# Altium project 48FE+2GE+2SFP.PrjPcb (part 4 of 9)

## Sheet 15_FE_PORT_1-8.SchDoc
size 594 x 420 mm; Author: Serbinov O.A.; CompanyName: ELSICOM; DrawnBy: Serbinov O.A.; Engineer: Serbinov O.A.; Organization: Elsicom; Address1: Kirova avenue, 58; Address2: Tomsk; Address3: Russia 634012; DocumentNumber: 16; SheetNumber: 16; SheetTotal: 44; ProjectName: 48_PORTS
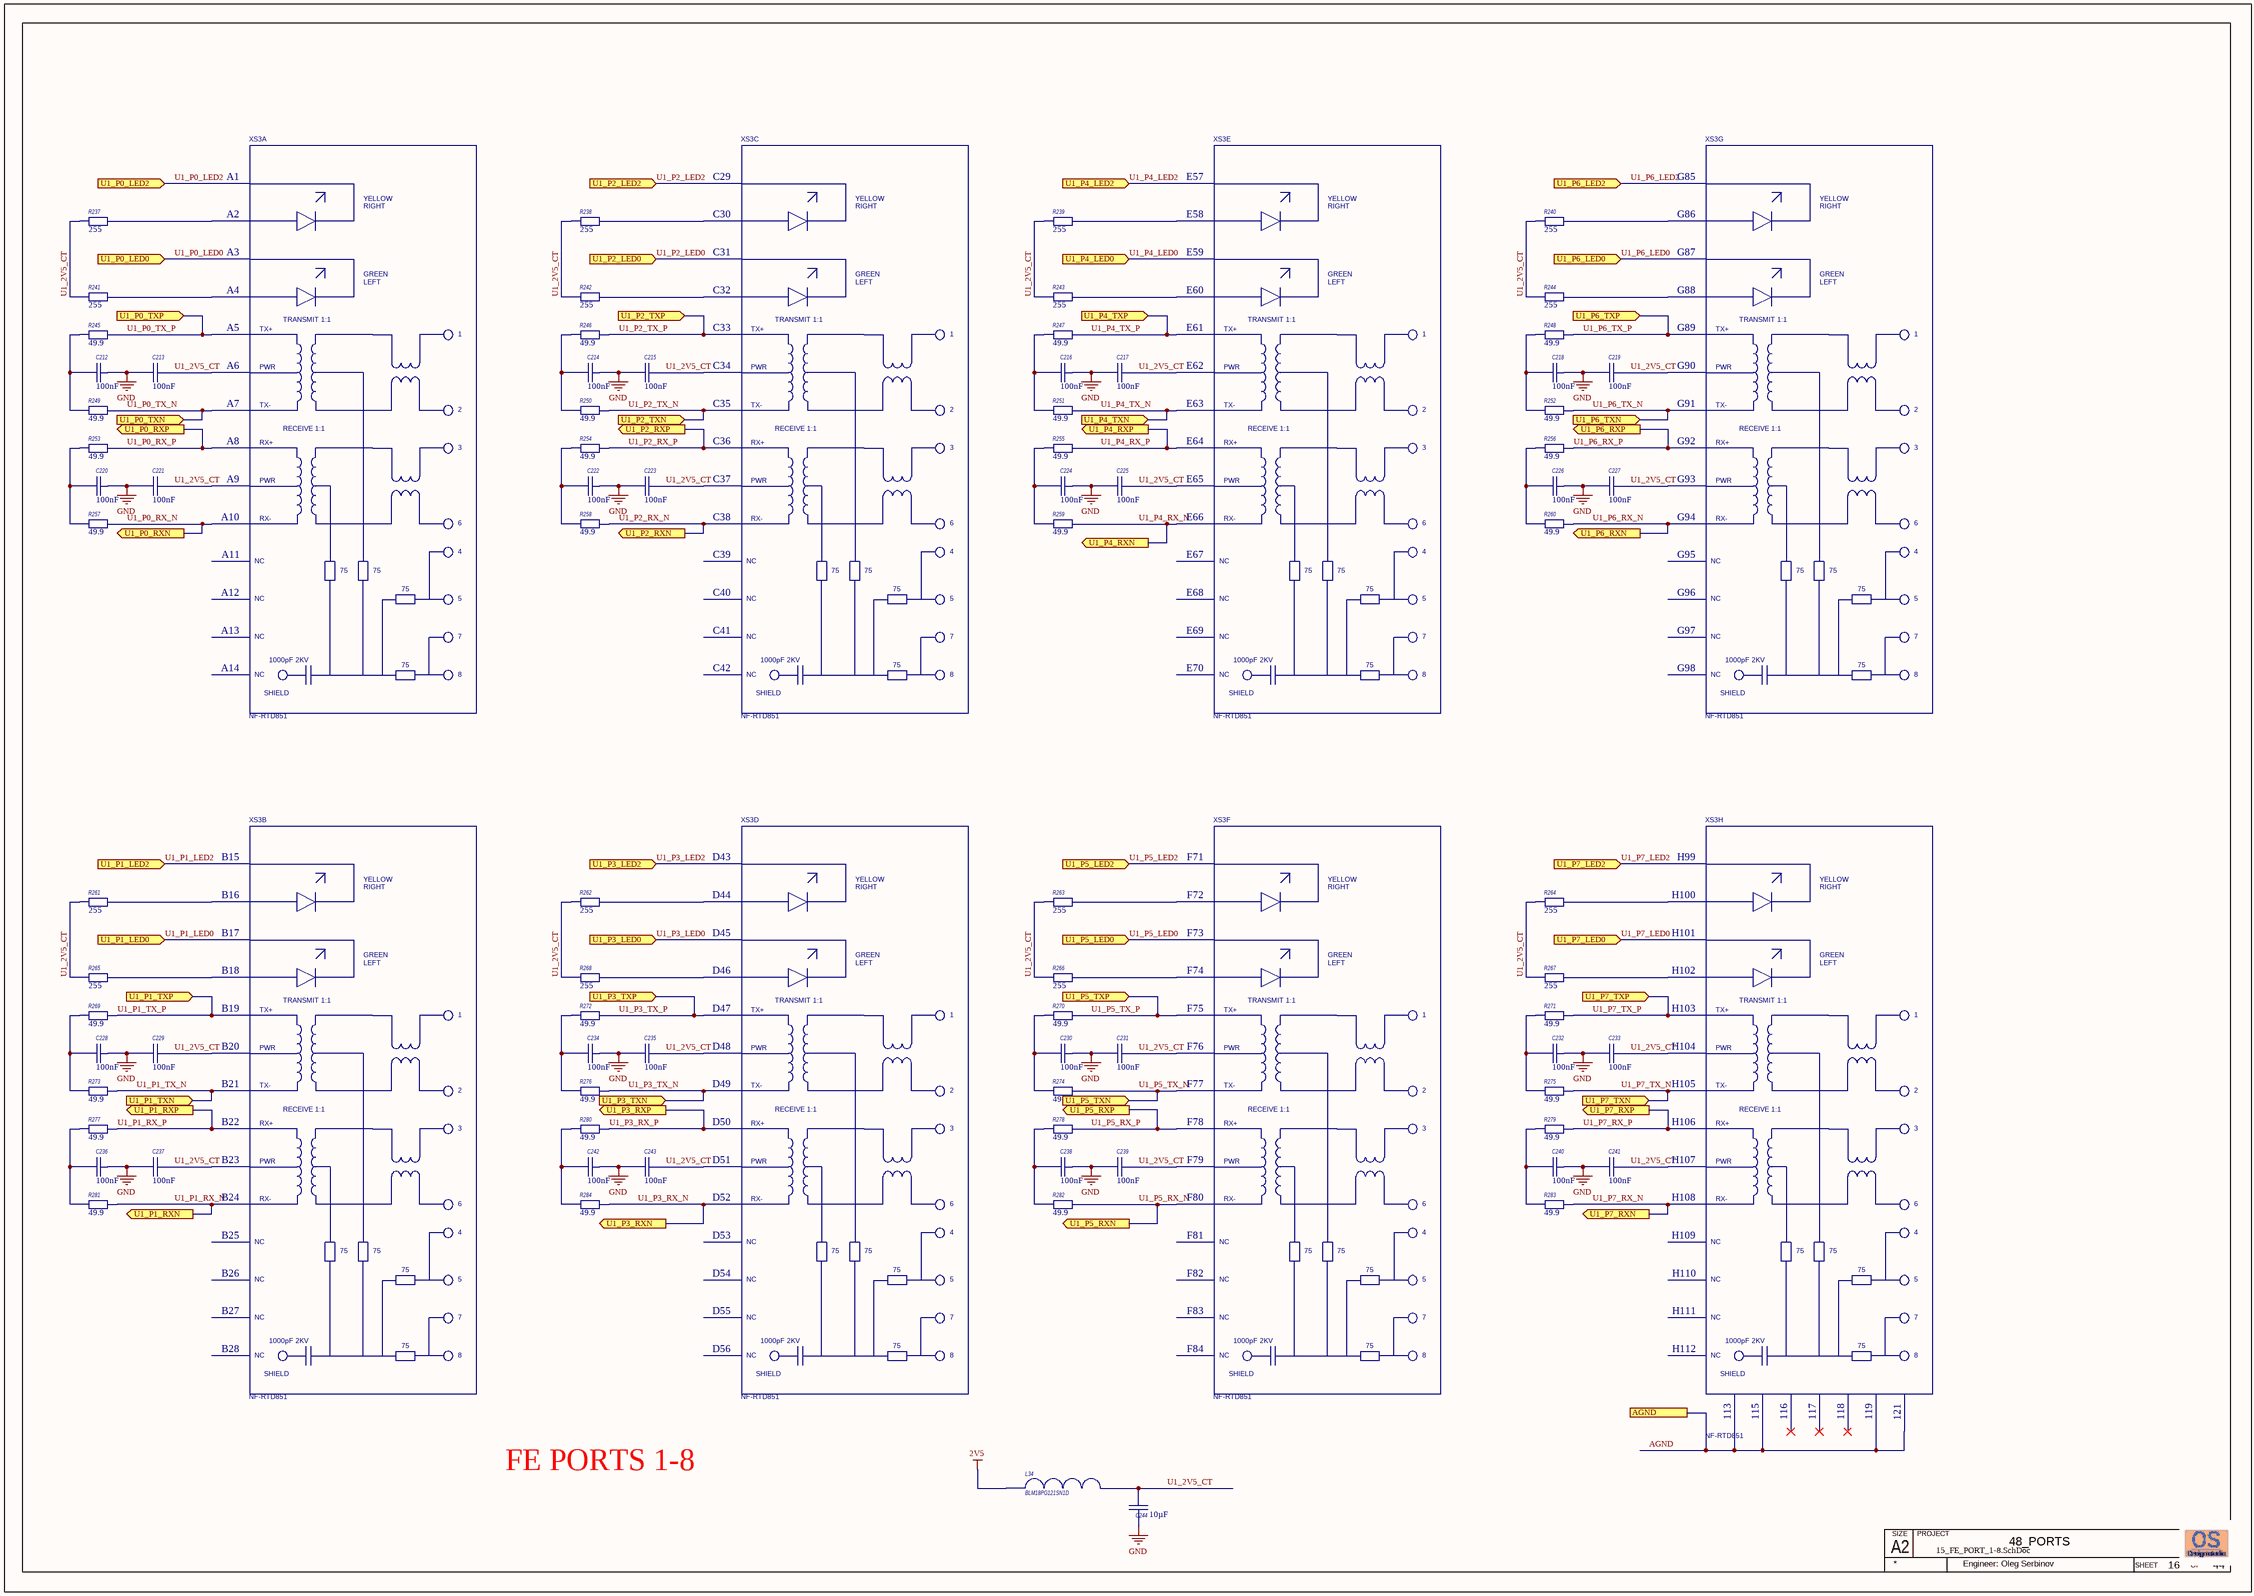
[diagram p9: 15_FE_PORT_1-8.SchDoc]

### Parts
C212  Capacitance: 100nF  [C0402_IPC High Density]  (hidden comment: GRM155R71E104KE14D)
C213  Capacitance: 100nF  [C0402_IPC High Density]  (hidden comment: GRM155R71E104KE14D)
C214  Capacitance: 100nF  [C0402_IPC High Density]  (hidden comment: GRM155R71E104KE14D)
C215  Capacitance: 100nF  [C0402_IPC High Density]  (hidden comment: GRM155R71E104KE14D)
C216  Capacitance: 100nF  [C0402_IPC High Density]  (hidden comment: GRM155R71E104KE14D)
C217  Capacitance: 100nF  [C0402_IPC High Density]  (hidden comment: GRM155R71E104KE14D)
C218  Capacitance: 100nF  [C0402_IPC High Density]  (hidden comment: GRM155R71E104KE14D)
C219  Capacitance: 100nF  [C0402_IPC High Density]  (hidden comment: GRM155R71E104KE14D)
C220  Capacitance: 100nF  [C0402_IPC High Density]  (hidden comment: GRM155R71E104KE14D)
C221  Capacitance: 100nF  [C0402_IPC High Density]  (hidden comment: GRM155R71E104KE14D)
C222  Capacitance: 100nF  [C0402_IPC High Density]  (hidden comment: GRM155R71E104KE14D)
C223  Capacitance: 100nF  [C0402_IPC High Density]  (hidden comment: GRM155R71E104KE14D)
C224  Capacitance: 100nF  [C0402_IPC High Density]  (hidden comment: GRM155R71E104KE14D)
C225  Capacitance: 100nF  [C0402_IPC High Density]  (hidden comment: GRM155R71E104KE14D)
C226  Capacitance: 100nF  [C0402_IPC High Density]  (hidden comment: GRM155R71E104KE14D)
C227  Capacitance: 100nF  [C0402_IPC High Density]  (hidden comment: GRM155R71E104KE14D)
C228  Capacitance: 100nF  [C0402_IPC High Density]  (hidden comment: GRM155R71E104KE14D)
C229  Capacitance: 100nF  [C0402_IPC High Density]  (hidden comment: GRM155R71E104KE14D)
C230  Capacitance: 100nF  [C0402_IPC High Density]  (hidden comment: GRM155R71E104KE14D)
C231  Capacitance: 100nF  [C0402_IPC High Density]  (hidden comment: GRM155R71E104KE14D)
C232  Capacitance: 100nF  [C0402_IPC High Density]  (hidden comment: GRM155R71E104KE14D)
C233  Capacitance: 100nF  [C0402_IPC High Density]  (hidden comment: GRM155R71E104KE14D)
C234  Capacitance: 100nF  [C0402_IPC High Density]  (hidden comment: GRM155R71E104KE14D)
C235  Capacitance: 100nF  [C0402_IPC High Density]  (hidden comment: GRM155R71E104KE14D)
C236  Capacitance: 100nF  [C0402_IPC High Density]  (hidden comment: GRM155R71E104KE14D)
C237  Capacitance: 100nF  [C0402_IPC High Density]  (hidden comment: GRM155R71E104KE14D)
C238  Capacitance: 100nF  [C0402_IPC High Density]  (hidden comment: GRM155R71E104KE14D)
C239  Capacitance: 100nF  [C0402_IPC High Density]  (hidden comment: GRM155R71E104KE14D)
C240  Capacitance: 100nF  [C0402_IPC High Density]  (hidden comment: GRM155R71E104KE14D)
C241  Capacitance: 100nF  [C0402_IPC High Density]  (hidden comment: GRM155R71E104KE14D)
C242  Capacitance: 100nF  [C0402_IPC High Density]  (hidden comment: GRM155R71E104KE14D)
C243  Capacitance: 100nF  [C0402_IPC High Density]  (hidden comment: GRM155R71E104KE14D)
C244  Capacitance: 10µF  [CAPC2012[0805]]  (hidden comment: GRM21BR61C106KE15)
L34  BLM18PG121SN1D  [INDC1608X95N]
R237  Resistance (Ohms): 255  [RESC1005[0402]]  (hidden comment: ERJ-2RKF2550X)
R238  Resistance (Ohms): 255  [RESC1005[0402]]  (hidden comment: ERJ-2RKF2550X)
R239  Resistance (Ohms): 255  [RESC1005[0402]]  (hidden comment: ERJ-2RKF2550X)
R240  Resistance (Ohms): 255  [RESC1005[0402]]  (hidden comment: ERJ-2RKF2550X)
R241  Resistance (Ohms): 255  [RESC1005[0402]]  (hidden comment: ERJ-2RKF2550X)
R242  Resistance (Ohms): 255  [RESC1005[0402]]  (hidden comment: ERJ-2RKF2550X)
R243  Resistance (Ohms): 255  [RESC1005[0402]]  (hidden comment: ERJ-2RKF2550X)
R244  Resistance (Ohms): 255  [RESC1005[0402]]  (hidden comment: ERJ-2RKF2550X)
R245  Resistance: 49.9  [R0402_IPC High Density]  (hidden comment: ERJ-2RKF49R9X)
R246  Resistance: 49.9  [R0402_IPC High Density]  (hidden comment: ERJ-2RKF49R9X)
R247  Resistance: 49.9  [R0402_IPC High Density]  (hidden comment: ERJ-2RKF49R9X)
R248  Resistance: 49.9  [R0402_IPC High Density]  (hidden comment: ERJ-2RKF49R9X)
R249  Resistance: 49.9  [R0402_IPC High Density]  (hidden comment: ERJ-2RKF49R9X)
R250  Resistance: 49.9  [R0402_IPC High Density]  (hidden comment: ERJ-2RKF49R9X)
R251  Resistance: 49.9  [R0402_IPC High Density]  (hidden comment: ERJ-2RKF49R9X)
R252  Resistance: 49.9  [R0402_IPC High Density]  (hidden comment: ERJ-2RKF49R9X)
R253  Resistance: 49.9  [R0402_IPC High Density]  (hidden comment: ERJ-2RKF49R9X)
R254  Resistance: 49.9  [R0402_IPC High Density]  (hidden comment: ERJ-2RKF49R9X)
R255  Resistance: 49.9  [R0402_IPC High Density]  (hidden comment: ERJ-2RKF49R9X)
R256  Resistance: 49.9  [R0402_IPC High Density]  (hidden comment: ERJ-2RKF49R9X)
R257  Resistance: 49.9  [R0402_IPC High Density]  (hidden comment: ERJ-2RKF49R9X)
R258  Resistance: 49.9  [R0402_IPC High Density]  (hidden comment: ERJ-2RKF49R9X)
R259  Resistance: 49.9  [R0402_IPC High Density]  (hidden comment: ERJ-2RKF49R9X)
R260  Resistance: 49.9  [R0402_IPC High Density]  (hidden comment: ERJ-2RKF49R9X)
R261  Resistance (Ohms): 255  [RESC1005[0402]]  (hidden comment: ERJ-2RKF2550X)
R262  Resistance (Ohms): 255  [RESC1005[0402]]  (hidden comment: ERJ-2RKF2550X)
R263  Resistance (Ohms): 255  [RESC1005[0402]]  (hidden comment: ERJ-2RKF2550X)
R264  Resistance (Ohms): 255  [RESC1005[0402]]  (hidden comment: ERJ-2RKF2550X)
R265  Resistance (Ohms): 255  [RESC1005[0402]]  (hidden comment: ERJ-2RKF2550X)
R266  Resistance (Ohms): 255  [RESC1005[0402]]  (hidden comment: ERJ-2RKF2550X)
R267  Resistance (Ohms): 255  [RESC1005[0402]]  (hidden comment: ERJ-2RKF2550X)
R268  Resistance (Ohms): 255  [RESC1005[0402]]  (hidden comment: ERJ-2RKF2550X)
R269  Resistance: 49.9  [R0402_IPC High Density]  (hidden comment: ERJ-2RKF49R9X)
R270  Resistance: 49.9  [R0402_IPC High Density]  (hidden comment: ERJ-2RKF49R9X)
R271  Resistance: 49.9  [R0402_IPC High Density]  (hidden comment: ERJ-2RKF49R9X)
R272  Resistance: 49.9  [R0402_IPC High Density]  (hidden comment: ERJ-2RKF49R9X)
R273  Resistance: 49.9  [R0402_IPC High Density]  (hidden comment: ERJ-2RKF49R9X)
R274  Resistance: 49.9  [R0402_IPC High Density]  (hidden comment: ERJ-2RKF49R9X)
R275  Resistance: 49.9  [R0402_IPC High Density]  (hidden comment: ERJ-2RKF49R9X)
R276  Resistance: 49.9  [R0402_IPC High Density]  (hidden comment: ERJ-2RKF49R9X)
R277  Resistance: 49.9  [R0402_IPC High Density]  (hidden comment: ERJ-2RKF49R9X)
R278  Resistance: 49.9  [R0402_IPC High Density]  (hidden comment: ERJ-2RKF49R9X)
R279  Resistance: 49.9  [R0402_IPC High Density]  (hidden comment: ERJ-2RKF49R9X)
R280  Resistance: 49.9  [R0402_IPC High Density]  (hidden comment: ERJ-2RKF49R9X)
R281  Resistance: 49.9  [R0402_IPC High Density]  (hidden comment: ERJ-2RKF49R9X)
R282  Resistance: 49.9  [R0402_IPC High Density]  (hidden comment: ERJ-2RKF49R9X)
R283  Resistance: 49.9  [R0402_IPC High Density]  (hidden comment: ERJ-2RKF49R9X)
R284  Resistance: 49.9  [R0402_IPC High Density]  (hidden comment: ERJ-2RKF49R9X)
XS3  NF-RTD851  [NF-RTD851_2X4_LED_NF-RTD851_2X4_LED(Primary)]  (parts A,B,C,D,E,F,G,H of 8)

### Ports
AGND, U1_P0_LED0 (in), U1_P0_LED2 (in), U1_P0_RXN (out), U1_P0_RXP (out), U1_P0_TXN (in), U1_P0_TXP (in), U1_P1_LED0 (in), U1_P1_LED2 (in), U1_P1_RXN (out), U1_P1_RXP (out), U1_P1_TXN (in), U1_P1_TXP (in), U1_P2_LED0 (in), U1_P2_LED2 (in), U1_P2_RXN (out), U1_P2_RXP (out), U1_P2_TXN (in), U1_P2_TXP (in), U1_P3_LED0 (in), U1_P3_LED2 (in), U1_P3_RXN (out), U1_P3_RXP (out), U1_P3_TXN (in), U1_P3_TXP (in), U1_P4_LED0 (in), U1_P4_LED2 (in), U1_P4_RXN (out), U1_P4_RXP (out), U1_P4_TXN (in), U1_P4_TXP (in), U1_P5_LED0 (in), U1_P5_LED2 (in), U1_P5_RXN (out), U1_P5_RXP (out), U1_P5_TXN (in), U1_P5_TXP (in), U1_P6_LED0 (in), U1_P6_LED2 (in), U1_P6_RXN (out), U1_P6_RXP (out), U1_P6_TXN (in), U1_P6_TXP (in), U1_P7_LED0 (in), U1_P7_LED2 (in), U1_P7_RXN (out), U1_P7_RXP (out), U1_P7_TXN (in), U1_P7_TXP (in)

### Nets
2V5: L34.1
GND: C212.2 C213.1 C214.2 C215.1 C216.2 C217.1 C218.2 C219.1 C220.2 C221.1 C222.2 C223.1 C224.2 C225.1 C226.2 C227.1 C228.2 C229.1 C230.2 C231.1 C232.2 C233.1 C234.2 C235.1 C236.2 C237.1 C238.2 C239.1 C240.2 C241.1 C242.2 C243.1 C244.1
AGND: XS3.113 XS3.115 XS3.119 XS3.121 ; port AGND
U1_2V5_CT: C213.2 C215.2 C217.2 C219.2 C221.2 C223.2 C225.2 C227.2 C229.2 C231.2 C233.2 C235.2 C237.2 C239.2 C241.2 C243.2 C244.2 L34.2 R237.1 R238.1 R239.1 R240.1 R241.1 R242.1 R243.1 R244.1 R261.1 R262.1 R263.1 R264.1 R265.1 R266.1 R267.1 R268.1 XS3.A6 XS3.A9 XS3.B20 XS3.B23 XS3.C34 XS3.C37 XS3.D48 XS3.D51 XS3.E62 XS3.E65 XS3.F76 XS3.F79 XS3.G90 XS3.G93 XS3.H104 XS3.H107
U1_P0_LED0: XS3.A3 ; port U1_P0_LED0
U1_P0_LED2: XS3.A1 ; port U1_P0_LED2
U1_P0_RX_N: R257.2 XS3.A10 ; port U1_P0_RXN
U1_P0_RX_P: R253.2 XS3.A8 ; port U1_P0_RXP
U1_P0_TX_N: R249.2 XS3.A7 ; port U1_P0_TXN
U1_P0_TX_P: R245.2 XS3.A5 ; port U1_P0_TXP
U1_P1_LED0: XS3.B17 ; port U1_P1_LED0
U1_P1_LED2: XS3.B15 ; port U1_P1_LED2
U1_P1_RX_N: R281.2 XS3.B24 ; port U1_P1_RXN
U1_P1_RX_P: R277.2 XS3.B22 ; port U1_P1_RXP
U1_P1_TX_N: R273.2 XS3.B21 ; port U1_P1_TXN
U1_P1_TX_P: R269.2 XS3.B19 ; port U1_P1_TXP
U1_P2_LED0: XS3.C31 ; port U1_P2_LED0
U1_P2_LED2: XS3.C29 ; port U1_P2_LED2
U1_P2_RX_N: R258.2 XS3.C38 ; port U1_P2_RXN
U1_P2_RX_P: R254.2 XS3.C36 ; port U1_P2_RXP
U1_P2_TX_N: R250.2 XS3.C35 ; port U1_P2_TXN
U1_P2_TX_P: R246.2 XS3.C33 ; port U1_P2_TXP
U1_P3_LED0: XS3.D45 ; port U1_P3_LED0
U1_P3_LED2: XS3.D43 ; port U1_P3_LED2
U1_P3_RX_N: R284.2 XS3.D52 ; port U1_P3_RXN
U1_P3_RX_P: R280.2 XS3.D50 ; port U1_P3_RXP
U1_P3_TX_N: R276.2 XS3.D49 ; port U1_P3_TXN
U1_P3_TX_P: R272.2 XS3.D47 ; port U1_P3_TXP
U1_P4_LED0: XS3.E59 ; port U1_P4_LED0
U1_P4_LED2: XS3.E57 ; port U1_P4_LED2
U1_P4_RX_N: R259.2 XS3.E66 ; port U1_P4_RXN
U1_P4_RX_P: R255.2 XS3.E64 ; port U1_P4_RXP
U1_P4_TX_N: R251.2 XS3.E63 ; port U1_P4_TXN
U1_P4_TX_P: R247.2 XS3.E61 ; port U1_P4_TXP
U1_P5_LED0: XS3.F73 ; port U1_P5_LED0
U1_P5_LED2: XS3.F71 ; port U1_P5_LED2
U1_P5_RX_N: R282.2 XS3.F80 ; port U1_P5_RXN
U1_P5_RX_P: R278.2 XS3.F78 ; port U1_P5_RXP
U1_P5_TX_N: R274.2 XS3.F77 ; port U1_P5_TXN
U1_P5_TX_P: R270.2 XS3.F75 ; port U1_P5_TXP
U1_P6_LED0: XS3.G87 ; port U1_P6_LED0
U1_P6_LED2: XS3.G85 ; port U1_P6_LED2
U1_P6_RX_N: R260.2 XS3.G94 ; port U1_P6_RXN
U1_P6_RX_P: R256.2 XS3.G92 ; port U1_P6_RXP
U1_P6_TX_N: R252.2 XS3.G91 ; port U1_P6_TXN
U1_P6_TX_P: R248.2 XS3.G89 ; port U1_P6_TXP
U1_P7_LED0: XS3.H101 ; port U1_P7_LED0
U1_P7_LED2: XS3.H99 ; port U1_P7_LED2
U1_P7_RX_N: R283.2 XS3.H108 ; port U1_P7_RXN
U1_P7_RX_P: R279.2 XS3.H106 ; port U1_P7_RXP
U1_P7_TX_N: R275.2 XS3.H105 ; port U1_P7_TXN
U1_P7_TX_P: R271.2 XS3.H103 ; port U1_P7_TXP
NetC212_1: C212.1 R245.1 R249.1
NetC214_1: C214.1 R246.1 R250.1
NetC216_1: C216.1 R247.1 R251.1
NetC218_1: C218.1 R248.1 R252.1
NetC220_1: C220.1 R253.1 R257.1
NetC222_1: C222.1 R254.1 R258.1
NetC224_1: C224.1 R255.1 R259.1
NetC226_1: C226.1 R256.1 R260.1
NetC228_1: C228.1 R269.1 R273.1
NetC230_1: C230.1 R270.1 R274.1
NetC232_1: C232.1 R271.1 R275.1
NetC234_1: C234.1 R272.1 R276.1
NetC236_1: C236.1 R277.1 R281.1
NetC238_1: C238.1 R278.1 R282.1
NetC240_1: C240.1 R279.1 R283.1
NetC242_1: C242.1 R280.1 R284.1
NetR237_2: R237.2 XS3.A2
NetR238_2: R238.2 XS3.C30
NetR239_2: R239.2 XS3.E58
NetR240_2: R240.2 XS3.G86
NetR241_2: R241.2 XS3.A4
NetR242_2: R242.2 XS3.C32
NetR243_2: R243.2 XS3.E60
NetR244_2: R244.2 XS3.G88
NetR261_2: R261.2 XS3.B16
NetR262_2: R262.2 XS3.D44
NetR263_2: R263.2 XS3.F72
NetR264_2: R264.2 XS3.H100
NetR265_2: R265.2 XS3.B18
NetR266_2: R266.2 XS3.F74
NetR267_2: R267.2 XS3.H102
NetR268_2: R268.2 XS3.D46

Not connected (* = marked no-connect by the designer): XS3 114 116 117 118 120 A11 A12 A13 A14 B25 B26 B27 B28 C39 C40 C41 C42 D53 D54 D55 D56 E67 E68 E69 E70 F81 F82 F83 F84 G95 G96 G97 G98 H109 H110 H111 H112

### Notes on the sheet
- FE PORTS 1-8
- A2
- SIZE
- PROJECT
- SHEET
- OF
- Engineer: Oleg Serbinov
- (in symbol NF-RTD851 2X4 EMI LED, part A) YELLOW; RIGHT; GREEN; LEFT; TRANSMIT 1:1; TX+; 1; PWR; TX-; 2; RECEIVE 1:1; RX+; 3; RX-; 6; 4; NC; 75; 5; 7; 1000pF 2KV; 8; SHIELD
- (in symbol NF-RTD851 2X4 EMI LED, part B) YELLOW; RIGHT; GREEN; LEFT; TRANSMIT 1:1; TX+; 1; PWR; TX-; 2; RECEIVE 1:1; RX+; 3; RX-; 6; 4; NC; 75; 5; 7; 1000pF 2KV; 8; SHIELD
- (in symbol NF-RTD851 2X4 EMI LED, part C) YELLOW; RIGHT; GREEN; LEFT; TRANSMIT 1:1; TX+; 1; PWR; TX-; 2; RECEIVE 1:1; RX+; 3; RX-; 6; 4; NC; 75; 5; 7; 1000pF 2KV; 8; SHIELD
- (in symbol NF-RTD851 2X4 EMI LED, part D) YELLOW; RIGHT; GREEN; LEFT; TRANSMIT 1:1; TX+; 1; PWR; TX-; 2; RECEIVE 1:1; RX+; 3; RX-; 6; 4; NC; 75; 5; 7; 1000pF 2KV; 8; SHIELD
- (in symbol NF-RTD851 2X4 EMI LED, part E) YELLOW; RIGHT; GREEN; LEFT; TRANSMIT 1:1; TX+; 1; PWR; TX-; 2; RECEIVE 1:1; RX+; 3; RX-; 6; 4; NC; 75; 5; 7; 1000pF 2KV; 8; SHIELD
- (in symbol NF-RTD851 2X4 EMI LED, part F) YELLOW; RIGHT; GREEN; LEFT; TRANSMIT 1:1; TX+; 1; PWR; TX-; 2; RECEIVE 1:1; RX+; 3; RX-; 6; 4; NC; 75; 5; 7; 1000pF 2KV; 8; SHIELD
- (in symbol NF-RTD851 2X4 EMI LED, part G) YELLOW; RIGHT; GREEN; LEFT; TRANSMIT 1:1; TX+; 1; PWR; TX-; 2; RECEIVE 1:1; RX+; 3; RX-; 6; 4; NC; 75; 5; 7; 1000pF 2KV; 8; SHIELD
- (in symbol NF-RTD851 2X4 EMI LED, part H) YELLOW; RIGHT; GREEN; LEFT; TRANSMIT 1:1; TX+; 1; PWR; TX-; 2; RECEIVE 1:1; RX+; 3; RX-; 6; 4; NC; 75; 5; 7; 1000pF 2KV; 8; SHIELD

### Library data of the parts
C212-C243 = GRM155R71E104KE14D: as C489-C491 on sheet 13_PHY_FE_33-40; Manufacturer Part Number: GRM155R71E104KE14D; RoHS: YES; Packaging: Reel; Package / Case: 0402; ComponentLink1URL: http://www.farnell.com/datasheets/4360.pdf; ComponentLink1Description: http://www.farnell.com/datasheets/4360.pdf; Pricing: 10000=0.008593, 30000=0.007991 (GBP); Supplier 1: Farnell; Supplier Part Number 1: 1118151; Stock: 3; Dielectric Characteristic: X7R; Operating Temperature Min: -55; Operating Temperature Max: 125; Operating Temperature Range: -55°C to +125; Series: GRM Hi-Cap; Terminal Type: Surface Mount (SMD, SMT); Tolerance -: 10%; Voltage Rating V DC: 16
C244 = GRM21BR61C106KE15: as C488 on sheet 13_PHY_FE_33-40; Applications: General Purpose; Category: Capacitors; Operating Temperature: -55°C ~ 85°C; Package / Case: 0805 (2012 Metric); Size / Dimension: 0.079" L x 0.049" W (2.00mm x 1.25mm); Temperature Coefficient: X5R; Tolerance: ±10%; ComponentLink1URL: http://search.murata.co.jp/Ceramy/image/img/PDF/ENG/GRM21BR61C106KE15.pdf; ComponentLink1Description: http://search.murata.co.jp/Ceramy/image/img/PDF/ENG/GRM21BR61C106KE15.pdf; Pricing: 1=0.3, 10=0.25, 50=0.1408, 100=0.1252, 250=0.09392, 500=0.08294, 1000=0.07356 (USD); Voltage - Rated: 16V; Manufacturer Part Number: GRM21BR61C106KE15
L34 = BLM18PG121SN1D: as L52 on sheet 13_PHY_FE_33-40; RoHS: YES; Operating Temperature Min: -55; Mounting Type: SMD; Operating Temperature Max: +125; Package / Case: 0603; Impedance @ 100MHz Typ: 120; Resistance: 0.05; Supplier Part Number: 1515738; Supplier: Farnell; ComponentLink1URL: http://www.farnell.com/datasheets/5148.pdf; ComponentLink1Description: http://www.farnell.com/datasheets/5148.pdf; Pricing: 5=0.056, 50=0.041, 100=0.034, 250=0.028, 500=0.027 (GBP); Manufacturer Part Number: BLM18PG121SN1D; DC Current Rating: 2A; Analogs: MPZ1608S121ATAH0 ; CIC10P121NC ; MPZ1608S121ATDH5 ; BLM18PG121SH1D ; 742792625
R237-R244 R261-R268 = ERJ-2RKF2550X: R0402, 255R 1%; Manufacturer: Panasonic; Customer Part Number: Резистор, 255R, 0402, 1%; Temperature Coefficient: ±100ppm/°C; Power (Watts): 0.1W, 1/10W; Analogs: any suitable; Category: Resistors; Supplier: Digi-Key; Supplier Part Number: P255LDKR-ND; RoHS: RoHS Compliant; Manufacturer Part Number: ERJ-2RKF2550X; Packaging: Digi-Reel®; Composition: Thick Film; Number of Terminations: 2; Height: 0.016" (0.40mm); Size / Dimension: 0.039" L x 0.020" W (1.00mm x 0.50mm); Tolerance: ±1%; Features: -; Package / Case: 0402 (1005 Metric); ComponentLink1URL: http://industrial.panasonic.com/www-cgi/jvcr13pz.cgi?E+PZ+3+AOA0002+ERJ2RKF2550X+7+WW; ComponentLink1Description: http://industrial.panasonic.com/www-cgi/jvcr13pz.cgi?E+PZ+3+AOA0002+ERJ2RKF2550X+7+WW; Pricing: 1=0.1, 50=0.0242, 100=0.0184, 250=0.01364, 500=0.01008, 1000=0.00672, 5000=0.00473 (USD)
R245-R260 R269-R284 = ERJ-2RKF49R9X: R0402, 49.9R 1%; Manufacturer: Panasonic; Rpart number: RC0402FR-0749R9L ; RC1005F49R9CS ; MCR01MRTF49R9 ; CRCW040249R9FKED ; CR0402-FX-49R9GLF; Rmanufacturer: Yageo  Samsung  Stackpole Electronics  Rohm Semiconductor  Vishay Dale; Customer Part Number: Резистор, 49R9, 0402, 1%; Temperature Coefficient: 100 PPM / C; Voltage Rating: 50 Volts; Power Rating: 100 mWatts; Analogs: any suitable; Category: Thick Film Resistors - SMD; Supplier: Mouser; Supplier Part Number: 667-ERJ-2RKF49R9X; Manufacturer Part Number: ERJ-2RKF49R9X; Product Category: .; Minimum Order Quantity: 1; Series: ERJ; Product: Thick Film Resistors SMD; RoHS - Mouser: E; Reeling: True; Packaging: Reel; Termination Style: SMD/SMT; Package / Case: 0402 (1005 metric); Standard Pack Qty: 10000; Tolerance: 1 %; Operating Temperature Range: - 55 C to + 155 C; RoHS: RoHS Compliant By Exemption; Dimensions: 0.5 mm W x 1 mm L x 0.35 mm H; ComponentLink1URL: http://industrial.panasonic.com/www-data/pdf/AOA0000/AOA0000CE2.pdf; ComponentLink1Description: http://industrial.panasonic.com/www-data/pdf/AOA0000/AOA0000CE2.pdf; Pricing: 1=0.135, 25=0.032, 100=0.024, 250=0.018, 500=0.014, 1000=0.008, 2000=0.007, 5000=0.004 (AUD)
XS3 = NF-RTD851 2X4 EMI LED: Connector RJ45 100mb 8 ports and led  NF-RTD851; Customer Part Number: Разъем, NF-RTD851, CONN MAGJACK 8PORT 100 BASE-TX; Manufacturer: Shenzhen Newfly Electronics; NF-RTD851 2X4 EMI LED: NF-RTD851 2X4 EMI LED (100mb 8 ports and led); Analogs: SC863-F4-48-4222-C12, F4-48-4222-C12, 9812G-81015-8-S3L1TC-D; Manufacturer Part Number: NF-RTD851

## Sheet 16_FE_PORT_9-16.SchDoc
size 594 x 420 mm; Author: Serbinov O.A.; CompanyName: ELSICOM; DrawnBy: Serbinov O.A.; Engineer: Serbinov O.A.; Organization: Elsicom; Address1: Kirova avenue, 58; Address2: Tomsk; Address3: Russia 634012; DocumentNumber: 17; SheetNumber: 17; SheetTotal: 44; ProjectName: 48_PORTS
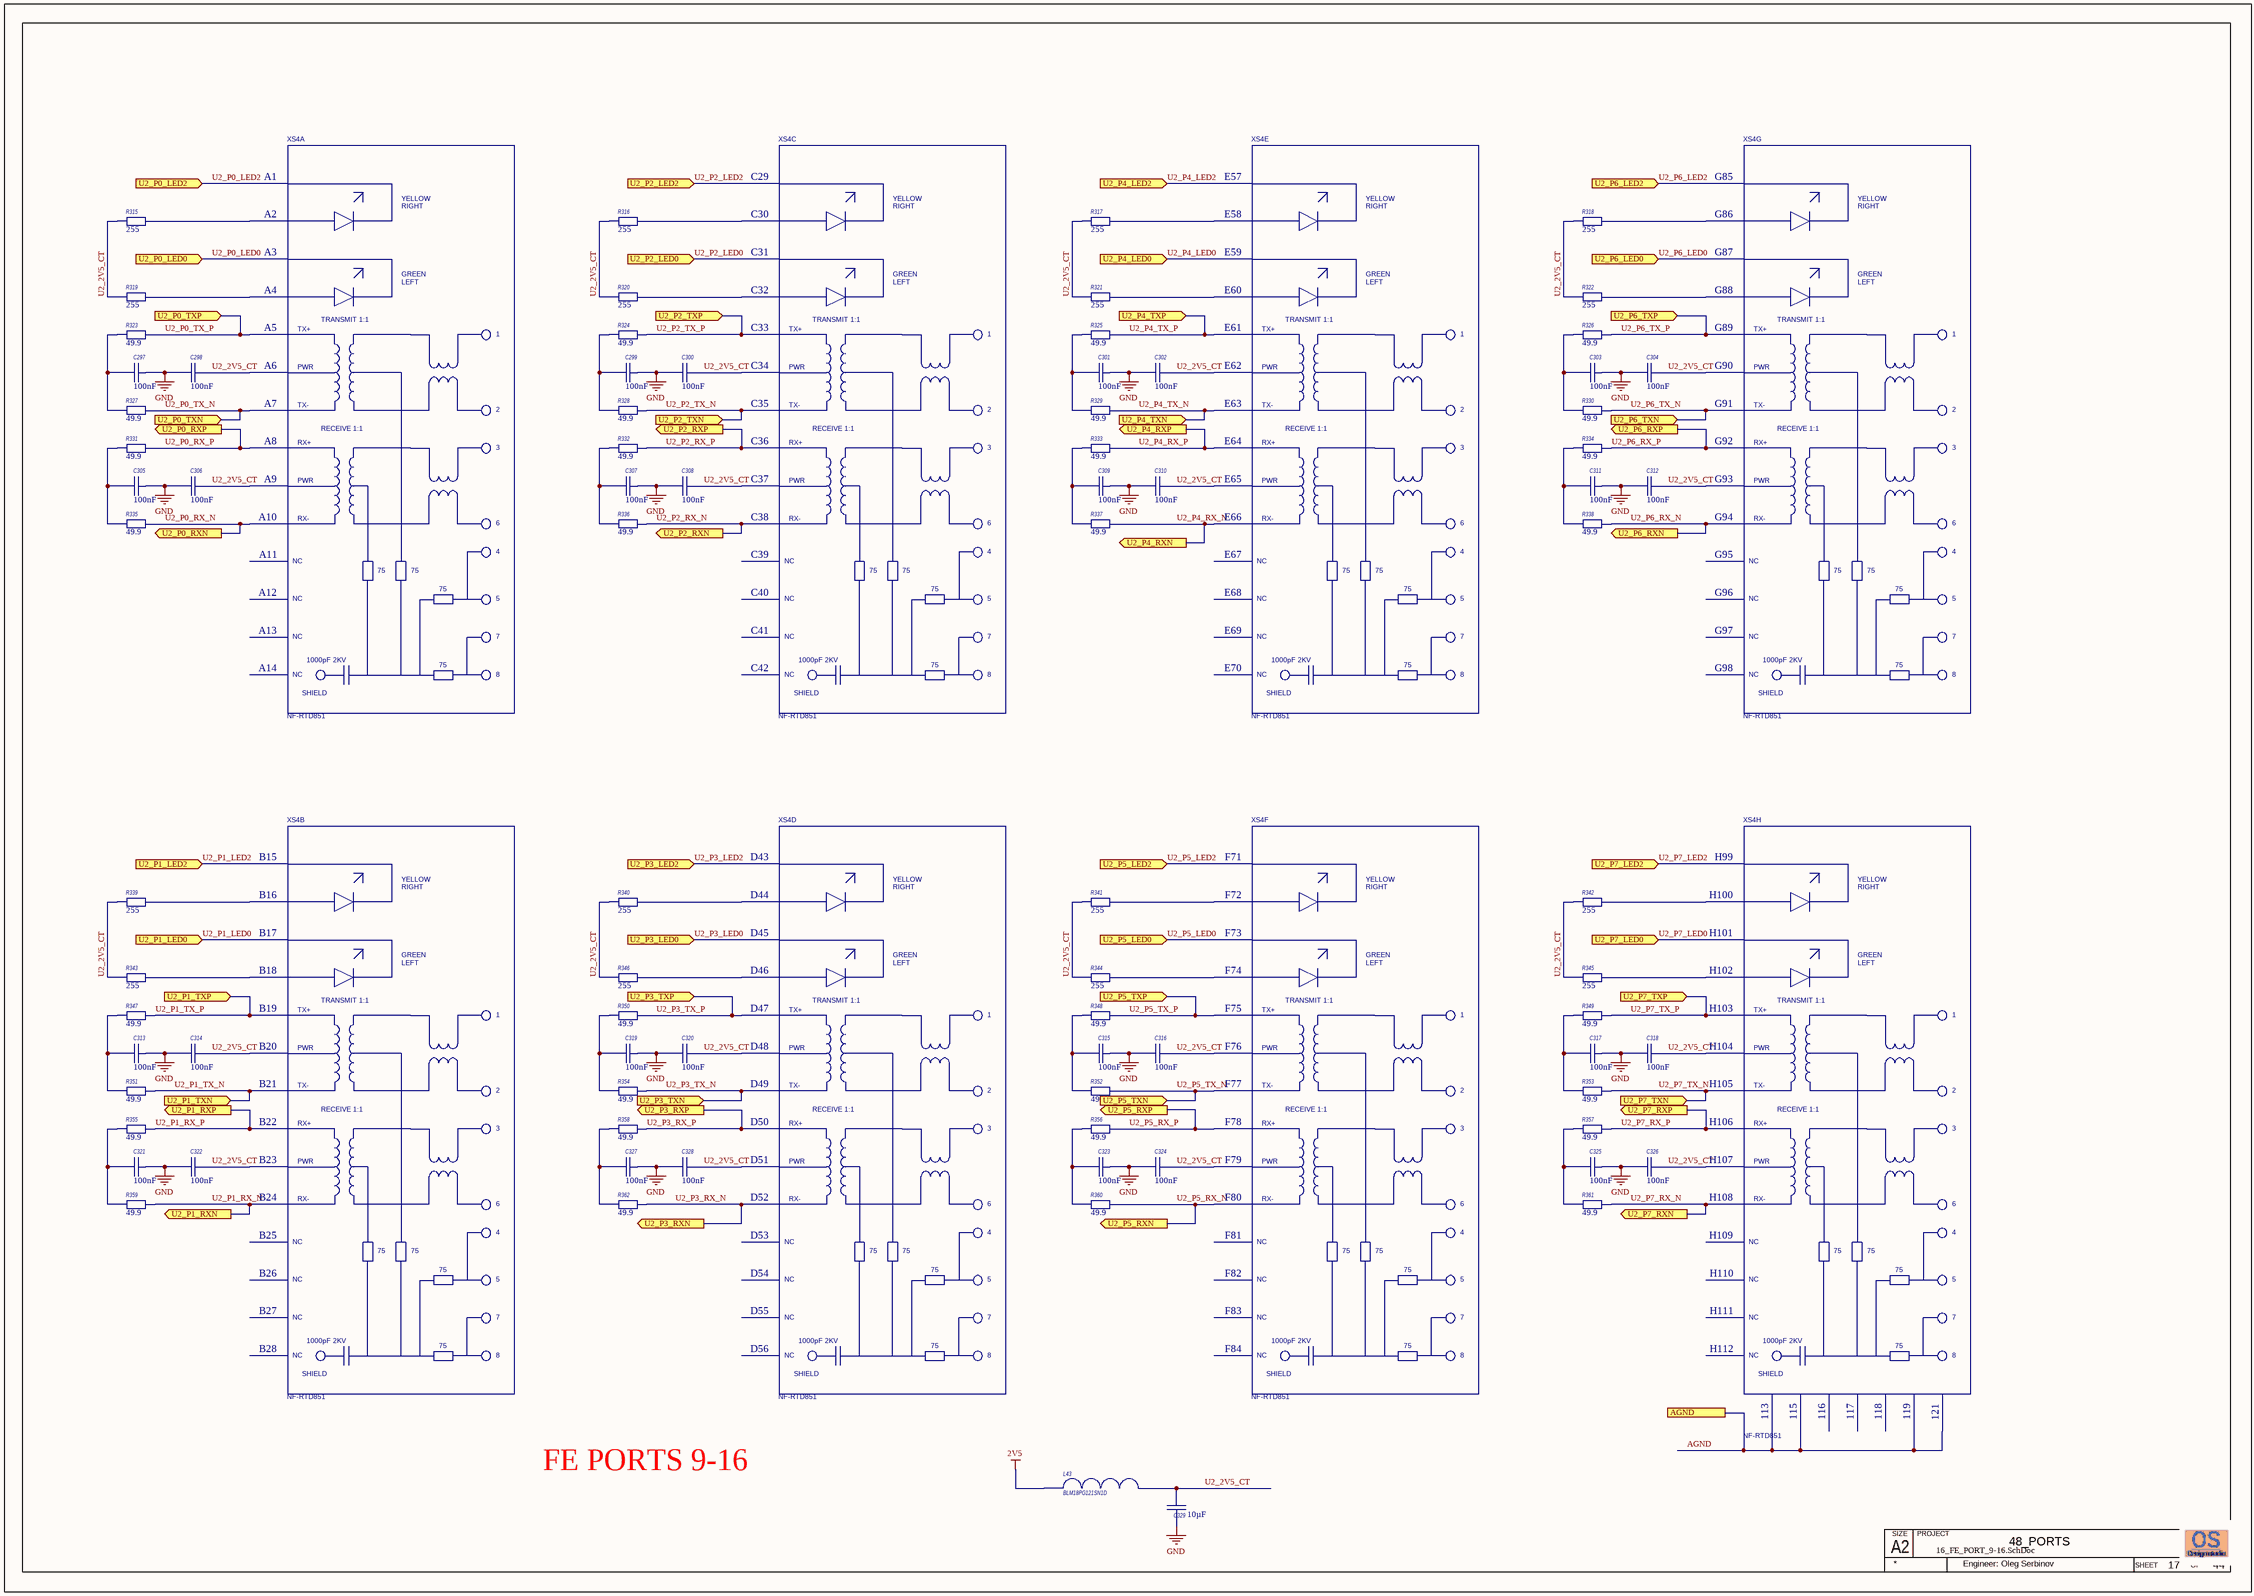
[diagram p10: 16_FE_PORT_9-16.SchDoc]

### Parts
C297  Capacitance: 100nF  [C0402_IPC High Density]  (hidden comment: GRM155R71E104KE14D)
C298  Capacitance: 100nF  [C0402_IPC High Density]  (hidden comment: GRM155R71E104KE14D)
C299  Capacitance: 100nF  [C0402_IPC High Density]  (hidden comment: GRM155R71E104KE14D)
C300  Capacitance: 100nF  [C0402_IPC High Density]  (hidden comment: GRM155R71E104KE14D)
C301  Capacitance: 100nF  [C0402_IPC High Density]  (hidden comment: GRM155R71E104KE14D)
C302  Capacitance: 100nF  [C0402_IPC High Density]  (hidden comment: GRM155R71E104KE14D)
C303  Capacitance: 100nF  [C0402_IPC High Density]  (hidden comment: GRM155R71E104KE14D)
C304  Capacitance: 100nF  [C0402_IPC High Density]  (hidden comment: GRM155R71E104KE14D)
C305  Capacitance: 100nF  [C0402_IPC High Density]  (hidden comment: GRM155R71E104KE14D)
C306  Capacitance: 100nF  [C0402_IPC High Density]  (hidden comment: GRM155R71E104KE14D)
C307  Capacitance: 100nF  [C0402_IPC High Density]  (hidden comment: GRM155R71E104KE14D)
C308  Capacitance: 100nF  [C0402_IPC High Density]  (hidden comment: GRM155R71E104KE14D)
C309  Capacitance: 100nF  [C0402_IPC High Density]  (hidden comment: GRM155R71E104KE14D)
C310  Capacitance: 100nF  [C0402_IPC High Density]  (hidden comment: GRM155R71E104KE14D)
C311  Capacitance: 100nF  [C0402_IPC High Density]  (hidden comment: GRM155R71E104KE14D)
C312  Capacitance: 100nF  [C0402_IPC High Density]  (hidden comment: GRM155R71E104KE14D)
C313  Capacitance: 100nF  [C0402_IPC High Density]  (hidden comment: GRM155R71E104KE14D)
C314  Capacitance: 100nF  [C0402_IPC High Density]  (hidden comment: GRM155R71E104KE14D)
C315  Capacitance: 100nF  [C0402_IPC High Density]  (hidden comment: GRM155R71E104KE14D)
C316  Capacitance: 100nF  [C0402_IPC High Density]  (hidden comment: GRM155R71E104KE14D)
C317  Capacitance: 100nF  [C0402_IPC High Density]  (hidden comment: GRM155R71E104KE14D)
C318  Capacitance: 100nF  [C0402_IPC High Density]  (hidden comment: GRM155R71E104KE14D)
C319  Capacitance: 100nF  [C0402_IPC High Density]  (hidden comment: GRM155R71E104KE14D)
C320  Capacitance: 100nF  [C0402_IPC High Density]  (hidden comment: GRM155R71E104KE14D)
C321  Capacitance: 100nF  [C0402_IPC High Density]  (hidden comment: GRM155R71E104KE14D)
C322  Capacitance: 100nF  [C0402_IPC High Density]  (hidden comment: GRM155R71E104KE14D)
C323  Capacitance: 100nF  [C0402_IPC High Density]  (hidden comment: GRM155R71E104KE14D)
C324  Capacitance: 100nF  [C0402_IPC High Density]  (hidden comment: GRM155R71E104KE14D)
C325  Capacitance: 100nF  [C0402_IPC High Density]  (hidden comment: GRM155R71E104KE14D)
C326  Capacitance: 100nF  [C0402_IPC High Density]  (hidden comment: GRM155R71E104KE14D)
C327  Capacitance: 100nF  [C0402_IPC High Density]  (hidden comment: GRM155R71E104KE14D)
C328  Capacitance: 100nF  [C0402_IPC High Density]  (hidden comment: GRM155R71E104KE14D)
C329  Capacitance: 10µF  [CAPC2012[0805]]  (hidden comment: GRM21BR61C106KE15)
L43  BLM18PG121SN1D  [INDC1608X95N]
R315  Resistance (Ohms): 255  [RESC1005[0402]]  (hidden comment: ERJ-2RKF2550X)
R316  Resistance (Ohms): 255  [RESC1005[0402]]  (hidden comment: ERJ-2RKF2550X)
R317  Resistance (Ohms): 255  [RESC1005[0402]]  (hidden comment: ERJ-2RKF2550X)
R318  Resistance (Ohms): 255  [RESC1005[0402]]  (hidden comment: ERJ-2RKF2550X)
R319  Resistance (Ohms): 255  [RESC1005[0402]]  (hidden comment: ERJ-2RKF2550X)
R320  Resistance (Ohms): 255  [RESC1005[0402]]  (hidden comment: ERJ-2RKF2550X)
R321  Resistance (Ohms): 255  [RESC1005[0402]]  (hidden comment: ERJ-2RKF2550X)
R322  Resistance (Ohms): 255  [RESC1005[0402]]  (hidden comment: ERJ-2RKF2550X)
R323  Resistance: 49.9  [R0402_IPC High Density]  (hidden comment: ERJ-2RKF49R9X)
R324  Resistance: 49.9  [R0402_IPC High Density]  (hidden comment: ERJ-2RKF49R9X)
R325  Resistance: 49.9  [R0402_IPC High Density]  (hidden comment: ERJ-2RKF49R9X)
R326  Resistance: 49.9  [R0402_IPC High Density]  (hidden comment: ERJ-2RKF49R9X)
R327  Resistance: 49.9  [R0402_IPC High Density]  (hidden comment: ERJ-2RKF49R9X)
R328  Resistance: 49.9  [R0402_IPC High Density]  (hidden comment: ERJ-2RKF49R9X)
R329  Resistance: 49.9  [R0402_IPC High Density]  (hidden comment: ERJ-2RKF49R9X)
R330  Resistance: 49.9  [R0402_IPC High Density]  (hidden comment: ERJ-2RKF49R9X)
R331  Resistance: 49.9  [R0402_IPC High Density]  (hidden comment: ERJ-2RKF49R9X)
R332  Resistance: 49.9  [R0402_IPC High Density]  (hidden comment: ERJ-2RKF49R9X)
R333  Resistance: 49.9  [R0402_IPC High Density]  (hidden comment: ERJ-2RKF49R9X)
R334  Resistance: 49.9  [R0402_IPC High Density]  (hidden comment: ERJ-2RKF49R9X)
R335  Resistance: 49.9  [R0402_IPC High Density]  (hidden comment: ERJ-2RKF49R9X)
R336  Resistance: 49.9  [R0402_IPC High Density]  (hidden comment: ERJ-2RKF49R9X)
R337  Resistance: 49.9  [R0402_IPC High Density]  (hidden comment: ERJ-2RKF49R9X)
R338  Resistance: 49.9  [R0402_IPC High Density]  (hidden comment: ERJ-2RKF49R9X)
R339  Resistance (Ohms): 255  [RESC1005[0402]]  (hidden comment: ERJ-2RKF2550X)
R340  Resistance (Ohms): 255  [RESC1005[0402]]  (hidden comment: ERJ-2RKF2550X)
R341  Resistance (Ohms): 255  [RESC1005[0402]]  (hidden comment: ERJ-2RKF2550X)
R342  Resistance (Ohms): 255  [RESC1005[0402]]  (hidden comment: ERJ-2RKF2550X)
R343  Resistance (Ohms): 255  [RESC1005[0402]]  (hidden comment: ERJ-2RKF2550X)
R344  Resistance (Ohms): 255  [RESC1005[0402]]  (hidden comment: ERJ-2RKF2550X)
R345  Resistance (Ohms): 255  [RESC1005[0402]]  (hidden comment: ERJ-2RKF2550X)
R346  Resistance (Ohms): 255  [RESC1005[0402]]  (hidden comment: ERJ-2RKF2550X)
R347  Resistance: 49.9  [R0402_IPC High Density]  (hidden comment: ERJ-2RKF49R9X)
R348  Resistance: 49.9  [R0402_IPC High Density]  (hidden comment: ERJ-2RKF49R9X)
R349  Resistance: 49.9  [R0402_IPC High Density]  (hidden comment: ERJ-2RKF49R9X)
R350  Resistance: 49.9  [R0402_IPC High Density]  (hidden comment: ERJ-2RKF49R9X)
R351  Resistance: 49.9  [R0402_IPC High Density]  (hidden comment: ERJ-2RKF49R9X)
R352  Resistance: 49.9  [R0402_IPC High Density]  (hidden comment: ERJ-2RKF49R9X)
R353  Resistance: 49.9  [R0402_IPC High Density]  (hidden comment: ERJ-2RKF49R9X)
R354  Resistance: 49.9  [R0402_IPC High Density]  (hidden comment: ERJ-2RKF49R9X)
R355  Resistance: 49.9  [R0402_IPC High Density]  (hidden comment: ERJ-2RKF49R9X)
R356  Resistance: 49.9  [R0402_IPC High Density]  (hidden comment: ERJ-2RKF49R9X)
R357  Resistance: 49.9  [R0402_IPC High Density]  (hidden comment: ERJ-2RKF49R9X)
R358  Resistance: 49.9  [R0402_IPC High Density]  (hidden comment: ERJ-2RKF49R9X)
R359  Resistance: 49.9  [R0402_IPC High Density]  (hidden comment: ERJ-2RKF49R9X)
R360  Resistance: 49.9  [R0402_IPC High Density]  (hidden comment: ERJ-2RKF49R9X)
R361  Resistance: 49.9  [R0402_IPC High Density]  (hidden comment: ERJ-2RKF49R9X)
R362  Resistance: 49.9  [R0402_IPC High Density]  (hidden comment: ERJ-2RKF49R9X)
XS4  NF-RTD851  [NF-RTD851_2X4_LED_NF-RTD851_2X4_LED(Primary)]  (parts A,B,C,D,E,F,G,H of 8)

### Ports
AGND, U2_P0_LED0 (in), U2_P0_LED2 (in), U2_P0_RXN (out), U2_P0_RXP (out), U2_P0_TXN (in), U2_P0_TXP (in), U2_P1_LED0 (in), U2_P1_LED2 (in), U2_P1_RXN (out), U2_P1_RXP (out), U2_P1_TXN (in), U2_P1_TXP (in), U2_P2_LED0 (in), U2_P2_LED2 (in), U2_P2_RXN (out), U2_P2_RXP (out), U2_P2_TXN (in), U2_P2_TXP (in), U2_P3_LED0 (in), U2_P3_LED2 (in), U2_P3_RXN (out), U2_P3_RXP (out), U2_P3_TXN (in), U2_P3_TXP (in), U2_P4_LED0 (in), U2_P4_LED2 (in), U2_P4_RXN (out), U2_P4_RXP (out), U2_P4_TXN (in), U2_P4_TXP (in), U2_P5_LED0 (in), U2_P5_LED2 (in), U2_P5_RXN (out), U2_P5_RXP (out), U2_P5_TXN (in), U2_P5_TXP (in), U2_P6_LED0 (in), U2_P6_LED2 (in), U2_P6_RXN (out), U2_P6_RXP (out), U2_P6_TXN (in), U2_P6_TXP (in), U2_P7_LED0 (in), U2_P7_LED2 (in), U2_P7_RXN (out), U2_P7_RXP (out), U2_P7_TXN (in), U2_P7_TXP (in)

### Nets
2V5: L43.1
GND: C297.2 C298.1 C299.2 C300.1 C301.2 C302.1 C303.2 C304.1 C305.2 C306.1 C307.2 C308.1 C309.2 C310.1 C311.2 C312.1 C313.2 C314.1 C315.2 C316.1 C317.2 C318.1 C319.2 C320.1 C321.2 C322.1 C323.2 C324.1 C325.2 C326.1 C327.2 C328.1 C329.1
AGND: XS4.113 XS4.115 XS4.119 XS4.121 ; port AGND
U2_2V5_CT: C298.2 C300.2 C302.2 C304.2 C306.2 C308.2 C310.2 C312.2 C314.2 C316.2 C318.2 C320.2 C322.2 C324.2 C326.2 C328.2 C329.2 L43.2 R315.1 R316.1 R317.1 R318.1 R319.1 R320.1 R321.1 R322.1 R339.1 R340.1 R341.1 R342.1 R343.1 R344.1 R345.1 R346.1 XS4.A6 XS4.A9 XS4.B20 XS4.B23 XS4.C34 XS4.C37 XS4.D48 XS4.D51 XS4.E62 XS4.E65 XS4.F76 XS4.F79 XS4.G90 XS4.G93 XS4.H104 XS4.H107
U2_P0_LED0: XS4.A3 ; port U2_P0_LED0
U2_P0_LED2: XS4.A1 ; port U2_P0_LED2
U2_P0_RX_N: R335.2 XS4.A10 ; port U2_P0_RXN
U2_P0_RX_P: R331.2 XS4.A8 ; port U2_P0_RXP
U2_P0_TX_N: R327.2 XS4.A7 ; port U2_P0_TXN
U2_P0_TX_P: R323.2 XS4.A5 ; port U2_P0_TXP
U2_P1_LED0: XS4.B17 ; port U2_P1_LED0
U2_P1_LED2: XS4.B15 ; port U2_P1_LED2
U2_P1_RX_N: R359.2 XS4.B24 ; port U2_P1_RXN
U2_P1_RX_P: R355.2 XS4.B22 ; port U2_P1_RXP
U2_P1_TX_N: R351.2 XS4.B21 ; port U2_P1_TXN
U2_P1_TX_P: R347.2 XS4.B19 ; port U2_P1_TXP
U2_P2_LED0: XS4.C31 ; port U2_P2_LED0
U2_P2_LED2: XS4.C29 ; port U2_P2_LED2
U2_P2_RX_N: R336.2 XS4.C38 ; port U2_P2_RXN
U2_P2_RX_P: R332.2 XS4.C36 ; port U2_P2_RXP
U2_P2_TX_N: R328.2 XS4.C35 ; port U2_P2_TXN
U2_P2_TX_P: R324.2 XS4.C33 ; port U2_P2_TXP
U2_P3_LED0: XS4.D45 ; port U2_P3_LED0
U2_P3_LED2: XS4.D43 ; port U2_P3_LED2
U2_P3_RX_N: R362.2 XS4.D52 ; port U2_P3_RXN
U2_P3_RX_P: R358.2 XS4.D50 ; port U2_P3_RXP
U2_P3_TX_N: R354.2 XS4.D49 ; port U2_P3_TXN
U2_P3_TX_P: R350.2 XS4.D47 ; port U2_P3_TXP
U2_P4_LED0: XS4.E59 ; port U2_P4_LED0
U2_P4_LED2: XS4.E57 ; port U2_P4_LED2
U2_P4_RX_N: R337.2 XS4.E66 ; port U2_P4_RXN
U2_P4_RX_P: R333.2 XS4.E64 ; port U2_P4_RXP
U2_P4_TX_N: R329.2 XS4.E63 ; port U2_P4_TXN
U2_P4_TX_P: R325.2 XS4.E61 ; port U2_P4_TXP
U2_P5_LED0: XS4.F73 ; port U2_P5_LED0
U2_P5_LED2: XS4.F71 ; port U2_P5_LED2
U2_P5_RX_N: R360.2 XS4.F80 ; port U2_P5_RXN
U2_P5_RX_P: R356.2 XS4.F78 ; port U2_P5_RXP
U2_P5_TX_N: R352.2 XS4.F77 ; port U2_P5_TXN
U2_P5_TX_P: R348.2 XS4.F75 ; port U2_P5_TXP
U2_P6_LED0: XS4.G87 ; port U2_P6_LED0
U2_P6_LED2: XS4.G85 ; port U2_P6_LED2
U2_P6_RX_N: R338.2 XS4.G94 ; port U2_P6_RXN
U2_P6_RX_P: R334.2 XS4.G92 ; port U2_P6_RXP
U2_P6_TX_N: R330.2 XS4.G91 ; port U2_P6_TXN
U2_P6_TX_P: R326.2 XS4.G89 ; port U2_P6_TXP
U2_P7_LED0: XS4.H101 ; port U2_P7_LED0
U2_P7_LED2: XS4.H99 ; port U2_P7_LED2
U2_P7_RX_N: R361.2 XS4.H108 ; port U2_P7_RXN
U2_P7_RX_P: R357.2 XS4.H106 ; port U2_P7_RXP
U2_P7_TX_N: R353.2 XS4.H105 ; port U2_P7_TXN
U2_P7_TX_P: R349.2 XS4.H103 ; port U2_P7_TXP
NetC297_1: C297.1 R323.1 R327.1
NetC299_1: C299.1 R324.1 R328.1
NetC301_1: C301.1 R325.1 R329.1
NetC303_1: C303.1 R326.1 R330.1
NetC305_1: C305.1 R331.1 R335.1
NetC307_1: C307.1 R332.1 R336.1
NetC309_1: C309.1 R333.1 R337.1
NetC311_1: C311.1 R334.1 R338.1
NetC313_1: C313.1 R347.1 R351.1
NetC315_1: C315.1 R348.1 R352.1
NetC317_1: C317.1 R349.1 R353.1
NetC319_1: C319.1 R350.1 R354.1
NetC321_1: C321.1 R355.1 R359.1
NetC323_1: C323.1 R356.1 R360.1
NetC325_1: C325.1 R357.1 R361.1
NetC327_1: C327.1 R358.1 R362.1
NetR315_2: R315.2 XS4.A2
NetR316_2: R316.2 XS4.C30
NetR317_2: R317.2 XS4.E58
NetR318_2: R318.2 XS4.G86
NetR319_2: R319.2 XS4.A4
NetR320_2: R320.2 XS4.C32
NetR321_2: R321.2 XS4.E60
NetR322_2: R322.2 XS4.G88
NetR339_2: R339.2 XS4.B16
NetR340_2: R340.2 XS4.D44
NetR341_2: R341.2 XS4.F72
NetR342_2: R342.2 XS4.H100
NetR343_2: R343.2 XS4.B18
NetR344_2: R344.2 XS4.F74
NetR345_2: R345.2 XS4.H102
NetR346_2: R346.2 XS4.D46

Not connected (* = marked no-connect by the designer): XS4 114 116 117 118 120 A11 A12 A13 A14 B25 B26 B27 B28 C39 C40 C41 C42 D53 D54 D55 D56 E67 E68 E69 E70 F81 F82 F83 F84 G95 G96 G97 G98 H109 H110 H111 H112

### Notes on the sheet
- FE PORTS 9-16
- A2
- SIZE
- PROJECT
- SHEET
- OF
- Engineer: Oleg Serbinov
- (in symbol NF-RTD851 2X4 EMI LED, part A) YELLOW; RIGHT; GREEN; LEFT; TRANSMIT 1:1; TX+; 1; PWR; TX-; 2; RECEIVE 1:1; RX+; 3; RX-; 6; 4; NC; 75; 5; 7; 1000pF 2KV; 8; SHIELD
- (in symbol NF-RTD851 2X4 EMI LED, part B) YELLOW; RIGHT; GREEN; LEFT; TRANSMIT 1:1; TX+; 1; PWR; TX-; 2; RECEIVE 1:1; RX+; 3; RX-; 6; 4; NC; 75; 5; 7; 1000pF 2KV; 8; SHIELD
- (in symbol NF-RTD851 2X4 EMI LED, part C) YELLOW; RIGHT; GREEN; LEFT; TRANSMIT 1:1; TX+; 1; PWR; TX-; 2; RECEIVE 1:1; RX+; 3; RX-; 6; 4; NC; 75; 5; 7; 1000pF 2KV; 8; SHIELD
- (in symbol NF-RTD851 2X4 EMI LED, part D) YELLOW; RIGHT; GREEN; LEFT; TRANSMIT 1:1; TX+; 1; PWR; TX-; 2; RECEIVE 1:1; RX+; 3; RX-; 6; 4; NC; 75; 5; 7; 1000pF 2KV; 8; SHIELD
- (in symbol NF-RTD851 2X4 EMI LED, part E) YELLOW; RIGHT; GREEN; LEFT; TRANSMIT 1:1; TX+; 1; PWR; TX-; 2; RECEIVE 1:1; RX+; 3; RX-; 6; 4; NC; 75; 5; 7; 1000pF 2KV; 8; SHIELD
- (in symbol NF-RTD851 2X4 EMI LED, part F) YELLOW; RIGHT; GREEN; LEFT; TRANSMIT 1:1; TX+; 1; PWR; TX-; 2; RECEIVE 1:1; RX+; 3; RX-; 6; 4; NC; 75; 5; 7; 1000pF 2KV; 8; SHIELD
- (in symbol NF-RTD851 2X4 EMI LED, part G) YELLOW; RIGHT; GREEN; LEFT; TRANSMIT 1:1; TX+; 1; PWR; TX-; 2; RECEIVE 1:1; RX+; 3; RX-; 6; 4; NC; 75; 5; 7; 1000pF 2KV; 8; SHIELD
- (in symbol NF-RTD851 2X4 EMI LED, part H) YELLOW; RIGHT; GREEN; LEFT; TRANSMIT 1:1; TX+; 1; PWR; TX-; 2; RECEIVE 1:1; RX+; 3; RX-; 6; 4; NC; 75; 5; 7; 1000pF 2KV; 8; SHIELD

### Library data of the parts
C297-C328 = GRM155R71E104KE14D: as C489-C491 on sheet 13_PHY_FE_33-40; Manufacturer Part Number: GRM155R71E104KE14D; RoHS: YES; Packaging: Reel; Package / Case: 0402; ComponentLink1URL: http://www.farnell.com/datasheets/4360.pdf; ComponentLink1Description: http://www.farnell.com/datasheets/4360.pdf; Pricing: 10000=0.008593, 30000=0.007991 (GBP); Supplier 1: Farnell; Supplier Part Number 1: 1118151; Stock: 3; Dielectric Characteristic: X7R; Operating Temperature Min: -55; Operating Temperature Max: 125; Operating Temperature Range: -55°C to +125; Series: GRM Hi-Cap; Terminal Type: Surface Mount (SMD, SMT); Tolerance -: 10%; Voltage Rating V DC: 16
C329 = GRM21BR61C106KE15: as C488 on sheet 13_PHY_FE_33-40; Applications: General Purpose; Category: Capacitors; Operating Temperature: -55°C ~ 85°C; Package / Case: 0805 (2012 Metric); Size / Dimension: 0.079" L x 0.049" W (2.00mm x 1.25mm); Temperature Coefficient: X5R; Tolerance: ±10%; ComponentLink1URL: http://search.murata.co.jp/Ceramy/image/img/PDF/ENG/GRM21BR61C106KE15.pdf; ComponentLink1Description: http://search.murata.co.jp/Ceramy/image/img/PDF/ENG/GRM21BR61C106KE15.pdf; Pricing: 1=0.3, 10=0.25, 50=0.1408, 100=0.1252, 250=0.09392, 500=0.08294, 1000=0.07356 (USD); Voltage - Rated: 16V; Manufacturer Part Number: GRM21BR61C106KE15
L43 = BLM18PG121SN1D: as L52 on sheet 13_PHY_FE_33-40; RoHS: YES; Operating Temperature Min: -55; Mounting Type: SMD; Operating Temperature Max: +125; Package / Case: 0603; Impedance @ 100MHz Typ: 120; Resistance: 0.05; Supplier Part Number: 1515738; Supplier: Farnell; ComponentLink1URL: http://www.farnell.com/datasheets/5148.pdf; ComponentLink1Description: http://www.farnell.com/datasheets/5148.pdf; Pricing: 5=0.056, 50=0.041, 100=0.034, 250=0.028, 500=0.027 (GBP); Manufacturer Part Number: BLM18PG121SN1D; DC Current Rating: 2A; Analogs: MPZ1608S121ATAH0 ; CIC10P121NC ; MPZ1608S121ATDH5 ; BLM18PG121SH1D ; 742792625
R315-R322 R339-R346 = ERJ-2RKF2550X: as R237-R244 on sheet 15_FE_PORT_1-8; Category: Resistors; Supplier: Digi-Key; Supplier Part Number: P255LDKR-ND; RoHS: RoHS Compliant; Manufacturer Part Number: ERJ-2RKF2550X; Packaging: Digi-Reel®; Composition: Thick Film; Number of Terminations: 2; Height: 0.016" (0.40mm); Size / Dimension: 0.039" L x 0.020" W (1.00mm x 0.50mm); Tolerance: ±1%; Features: -; Package / Case: 0402 (1005 Metric); ComponentLink1URL: http://industrial.panasonic.com/www-cgi/jvcr13pz.cgi?E+PZ+3+AOA0002+ERJ2RKF2550X+7+WW; ComponentLink1Description: http://industrial.panasonic.com/www-cgi/jvcr13pz.cgi?E+PZ+3+AOA0002+ERJ2RKF2550X+7+WW; Pricing: 1=0.1, 50=0.0242, 100=0.0184, 250=0.01364, 500=0.01008, 1000=0.00672, 5000=0.00473 (USD)
R323-R338 R347-R362 = ERJ-2RKF49R9X: as R245-R260 on sheet 15_FE_PORT_1-8; Category: Thick Film Resistors - SMD; Supplier: Mouser; Supplier Part Number: 667-ERJ-2RKF49R9X; Manufacturer Part Number: ERJ-2RKF49R9X; Product Category: .; Minimum Order Quantity: 1; Series: ERJ; Product: Thick Film Resistors SMD; RoHS - Mouser: E; Reeling: True; Packaging: Reel; Termination Style: SMD/SMT; Package / Case: 0402 (1005 metric); Standard Pack Qty: 10000; Tolerance: 1 %; Operating Temperature Range: - 55 C to + 155 C; RoHS: RoHS Compliant By Exemption; Dimensions: 0.5 mm W x 1 mm L x 0.35 mm H; ComponentLink1URL: http://industrial.panasonic.com/www-data/pdf/AOA0000/AOA0000CE2.pdf; ComponentLink1Description: http://industrial.panasonic.com/www-data/pdf/AOA0000/AOA0000CE2.pdf; Pricing: 1=0.135, 25=0.032, 100=0.024, 250=0.018, 500=0.014, 1000=0.008, 2000=0.007, 5000=0.004 (AUD)
XS4 = NF-RTD851 2X4 EMI LED: as XS3 on sheet 15_FE_PORT_1-8; Manufacturer Part Number: NF-RTD851